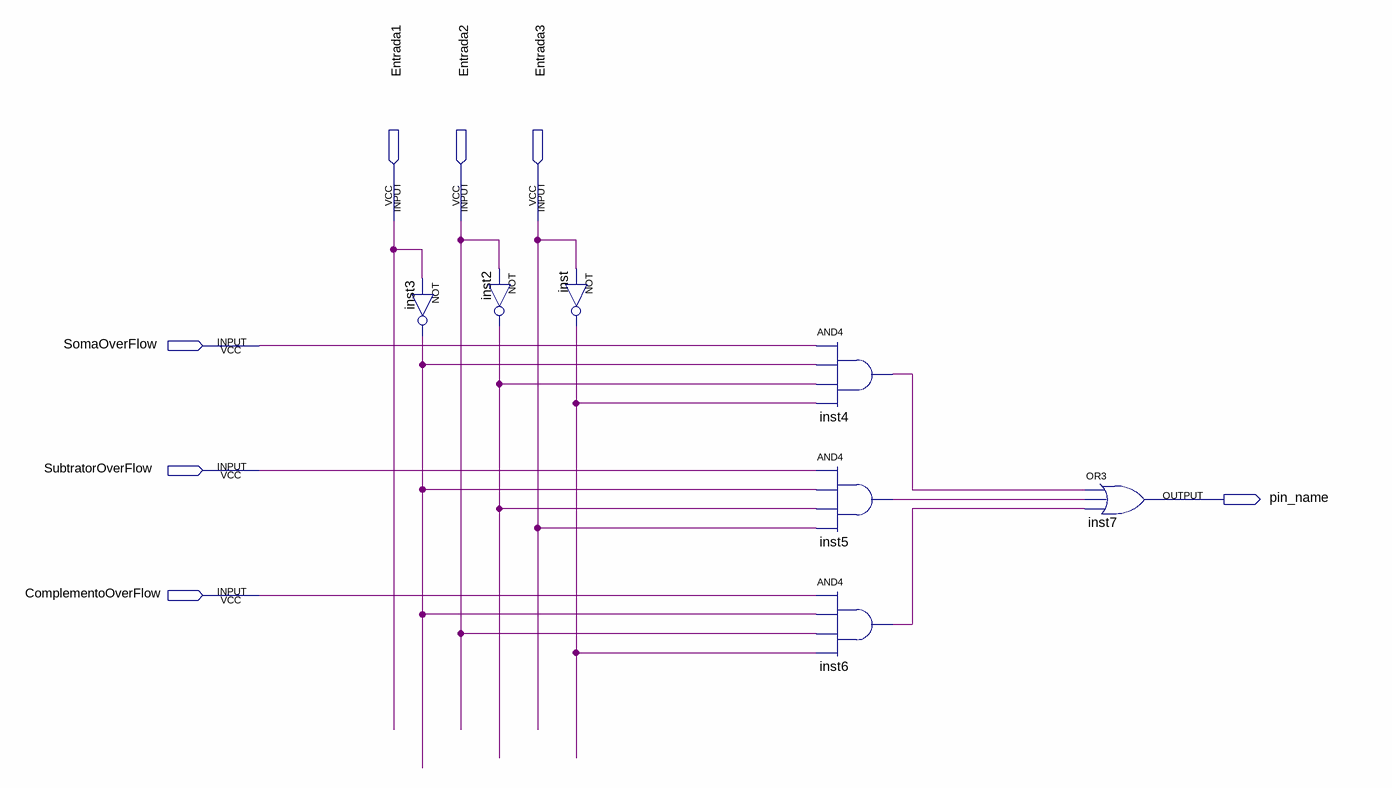
[diagram p0: schematic sheet]
// Quartus schematic Multiplex_overflow_completo.bdf as structural Verilog: 7 symbols, 7 pins
module Multiplex_overflow_completo (
  input  Entrada1,
  input  Entrada2,
  input  Entrada3,
  input  SomaOverFlow,
  input  SubtratorOverFlow,
  input  ComplementoOverFlow,
  output pin_name
);

  wire inst2_out, inst3_out, inst4_out, inst5_out, inst6_out, inst_out;

  not inst3 (inst3_out, Entrada1);
  not inst2 (inst2_out, Entrada2);
  not inst (inst_out, Entrada3);
  and inst4 (inst4_out, SomaOverFlow, inst3_out, inst2_out, inst_out);
  and inst5 (inst5_out, SubtratorOverFlow, inst3_out, inst2_out, Entrada3);
  and inst6 (inst6_out, ComplementoOverFlow, inst3_out, Entrada2, inst_out);
  or inst7 (pin_name, inst4_out, inst5_out, inst6_out);
endmodule
